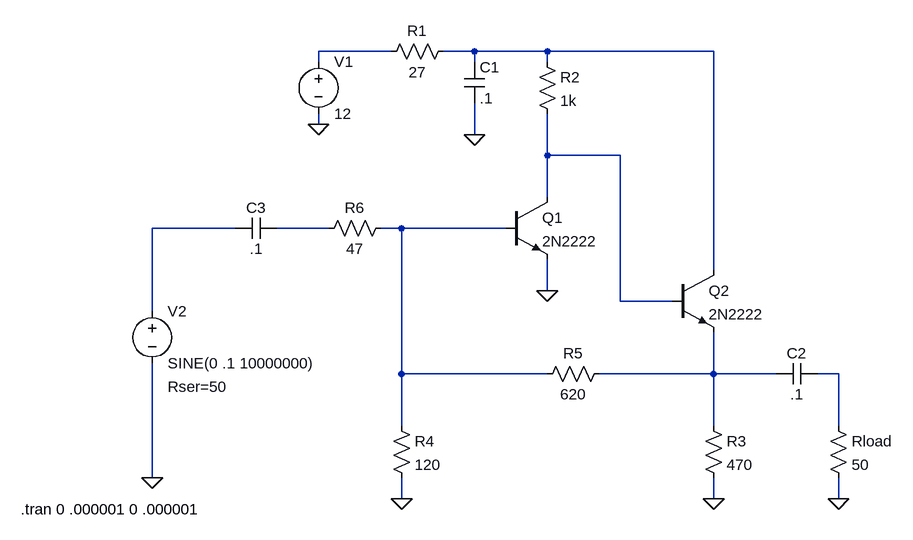
[diagram p0: schematic 23dbamp2n2222.asc]
23dbamp2n2222.asc, the LTspice schematic file:
Version 4
SHEET 1 1148 824
WIRE 0 496 0 368
WIRE 0 752 0 576
WIRE 128 368 0 368
WIRE 256 112 256 96
WIRE 256 208 256 192
WIRE 272 368 192 368
WIRE 368 96 256 96
WIRE 384 368 352 368
WIRE 384 592 384 368
WIRE 384 672 384 592
WIRE 384 784 384 752
WIRE 496 96 448 96
WIRE 496 112 496 96
WIRE 496 224 496 176
WIRE 544 368 384 368
WIRE 608 96 496 96
WIRE 608 112 608 96
WIRE 608 256 608 192
WIRE 608 320 608 256
WIRE 608 464 608 416
WIRE 608 592 384 592
WIRE 720 256 608 256
WIRE 720 480 720 256
WIRE 800 480 720 480
WIRE 864 96 608 96
WIRE 864 432 864 96
WIRE 864 592 688 592
WIRE 864 592 864 528
WIRE 864 672 864 592
WIRE 864 784 864 752
WIRE 960 592 864 592
WIRE 1056 592 1024 592
WIRE 1056 672 1056 592
WIRE 1056 784 1056 752
FLAG 256 208 0
FLAG 496 224 0
FLAG 608 464 0
FLAG 864 784 0
FLAG 1056 784 0
FLAG 384 784 0
FLAG 0 752 0
SYMBOL voltage 256 96 R0
WINDOW 123 0 0 Left 0
WINDOW 39 0 0 Left 0
SYMATTR InstName V1
SYMATTR Value 12
SYMBOL res 464 80 R90
WINDOW 0 0 56 VBottom 0
WINDOW 3 32 56 VTop 0
SYMATTR InstName R1
SYMATTR Value 27
SYMBOL cap 480 112 R0
SYMATTR InstName C1
SYMATTR Value .1
SYMBOL res 592 96 R0
SYMATTR InstName R2
SYMATTR Value 1k
SYMBOL npn 544 320 R0
SYMATTR InstName Q1
SYMATTR Value 2N2222
SYMBOL npn 800 432 R0
SYMATTR InstName Q2
SYMATTR Value 2N2222
SYMBOL res 848 656 R0
SYMATTR InstName R3
SYMATTR Value 470
SYMBOL cap 1024 576 R90
WINDOW 0 0 32 VBottom 0
WINDOW 3 32 32 VTop 0
SYMATTR InstName C2
SYMATTR Value .1
SYMBOL res 1040 656 R0
SYMATTR InstName Rload
SYMATTR Value 50
SYMBOL res 368 656 R0
SYMATTR InstName R4
SYMATTR Value 120
SYMBOL res 704 576 R90
WINDOW 0 0 56 VBottom 0
WINDOW 3 32 56 VTop 0
SYMATTR InstName R5
SYMATTR Value 620
SYMBOL res 368 352 R90
WINDOW 0 0 56 VBottom 0
WINDOW 3 32 56 VTop 0
SYMATTR InstName R6
SYMATTR Value 47
SYMBOL cap 192 352 R90
WINDOW 0 0 32 VBottom 0
WINDOW 3 32 32 VTop 0
SYMATTR InstName C3
SYMATTR Value .1
SYMBOL voltage 0 480 R0
WINDOW 123 0 0 Left 0
WINDOW 39 24 132 Left 0
SYMATTR InstName V2
SYMATTR Value SINE(0 .1 10000000)
SYMATTR SpiceLine Rser=50
TEXT -202 800 Left 0 !.tran 0 .000001 0 .000001

The netlist it stands for:
* 23dbamp2n2222.asc
V1 N002 0 12
R1 N005 N002 27
C1 N005 0 .1
R2 N005 N006 1k
Q1 N006 N004 0 0 2N2222
Q2 N005 N006 N007 0 2N2222
R3 N007 0 470
C2 N008 N007 .1
Rload N008 0 50
R4 N004 0 120
R5 N007 N004 620
R6 N004 N003 47
C3 N003 N001 .1
V2 N001 0 SINE(0 .1 10000000) Rser=50
.model NPN NPN
.model PNP PNP
.lib standard.bjt
.tran 0 .000001 0 .000001
.backanno
.end